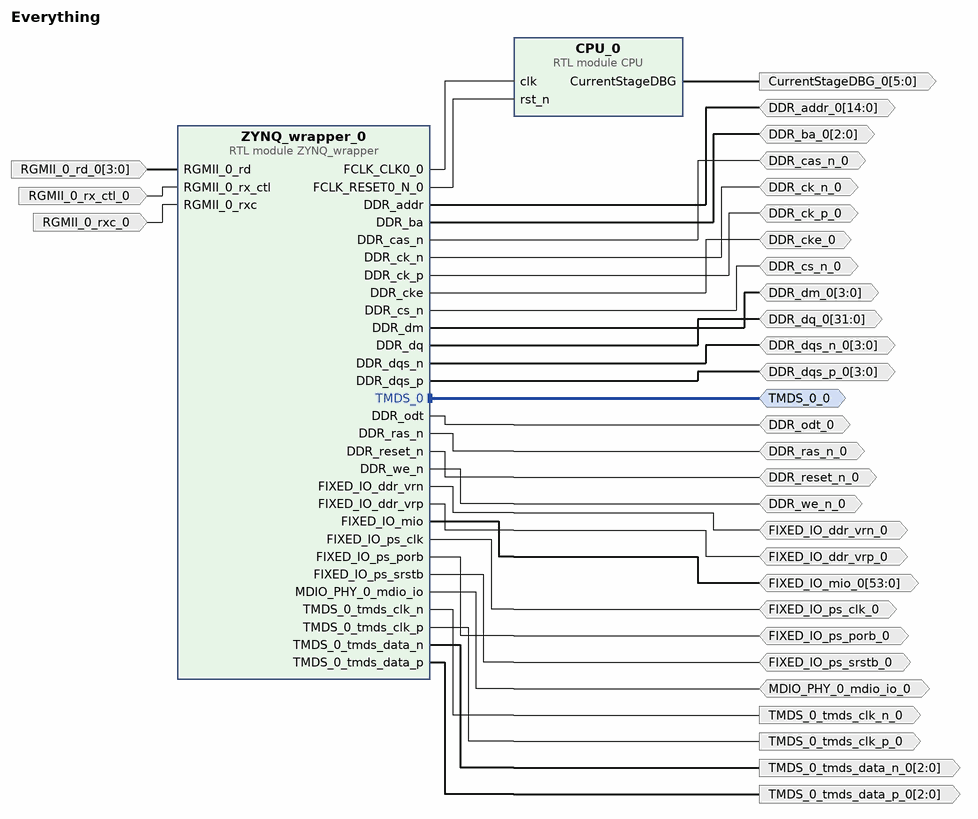
[diagram p0: block diagram of the top level]
# Vivado block design Everything, xc7z020clg484-1, Vivado 2024.1
create_bd_design Everything

create_bd_intf_port -mode Master -vlnv openedv.com:user:TMDS_rtl:1.0 TMDS_0_0
create_bd_port -dir IO -from 14 -to 0 DDR_addr_0
create_bd_port -dir IO -from 2 -to 0 DDR_ba_0
create_bd_port -dir IO DDR_cas_n_0
create_bd_port -dir IO DDR_ck_n_0
create_bd_port -dir IO DDR_ck_p_0
create_bd_port -dir IO DDR_cke_0
create_bd_port -dir IO DDR_cs_n_0
create_bd_port -dir IO -from 3 -to 0 DDR_dm_0
create_bd_port -dir IO -from 31 -to 0 DDR_dq_0
create_bd_port -dir IO -from 3 -to 0 DDR_dqs_n_0
create_bd_port -dir IO -from 3 -to 0 DDR_dqs_p_0
create_bd_port -dir IO DDR_odt_0
create_bd_port -dir IO DDR_ras_n_0
create_bd_port -dir IO DDR_reset_n_0
create_bd_port -dir IO DDR_we_n_0
create_bd_port -dir IO FIXED_IO_ddr_vrn_0
create_bd_port -dir IO FIXED_IO_ddr_vrp_0
create_bd_port -dir IO -from 53 -to 0 FIXED_IO_mio_0
create_bd_port -dir IO -type clk FIXED_IO_ps_clk_0
create_bd_port -dir IO FIXED_IO_ps_porb_0
create_bd_port -dir IO FIXED_IO_ps_srstb_0
create_bd_port -dir I -from 3 -to 0 RGMII_0_rd_0
create_bd_port -dir I RGMII_0_rx_ctl_0
create_bd_port -dir I RGMII_0_rxc_0
create_bd_port -dir IO MDIO_PHY_0_mdio_io_0
create_bd_port -dir O -from 2 -to 0 TMDS_0_tmds_data_n_0
create_bd_port -dir O -from 2 -to 0 TMDS_0_tmds_data_p_0
create_bd_port -dir O -type clk TMDS_0_tmds_clk_p_0
create_bd_port -dir O -type clk TMDS_0_tmds_clk_n_0
create_bd_port -dir O -from 5 -to 0 CurrentStageDBG_0

create_bd_cell -type module -reference CPU CPU_0
create_bd_cell -type module -reference ZYNQ_wrapper ZYNQ_wrapper_0

# ---- connections ----

connect_bd_intf_net [get_bd_intf_ports TMDS_0_0] [get_bd_intf_pins ZYNQ_wrapper_0/TMDS_0]
connect_bd_net [get_bd_pins CPU_0/CurrentStageDBG] [get_bd_ports CurrentStageDBG_0]
connect_bd_net [get_bd_ports DDR_addr_0] [get_bd_pins ZYNQ_wrapper_0/DDR_addr]
connect_bd_net [get_bd_ports DDR_ba_0] [get_bd_pins ZYNQ_wrapper_0/DDR_ba]
connect_bd_net [get_bd_ports DDR_cas_n_0] [get_bd_pins ZYNQ_wrapper_0/DDR_cas_n]
connect_bd_net [get_bd_ports DDR_ck_n_0] [get_bd_pins ZYNQ_wrapper_0/DDR_ck_n]
connect_bd_net [get_bd_ports DDR_ck_p_0] [get_bd_pins ZYNQ_wrapper_0/DDR_ck_p]
connect_bd_net [get_bd_ports DDR_cke_0] [get_bd_pins ZYNQ_wrapper_0/DDR_cke]
connect_bd_net [get_bd_ports DDR_cs_n_0] [get_bd_pins ZYNQ_wrapper_0/DDR_cs_n]
connect_bd_net [get_bd_ports DDR_dm_0] [get_bd_pins ZYNQ_wrapper_0/DDR_dm]
connect_bd_net [get_bd_ports DDR_dq_0] [get_bd_pins ZYNQ_wrapper_0/DDR_dq]
connect_bd_net [get_bd_ports DDR_dqs_n_0] [get_bd_pins ZYNQ_wrapper_0/DDR_dqs_n]
connect_bd_net [get_bd_ports DDR_dqs_p_0] [get_bd_pins ZYNQ_wrapper_0/DDR_dqs_p]
connect_bd_net [get_bd_ports DDR_odt_0] [get_bd_pins ZYNQ_wrapper_0/DDR_odt]
connect_bd_net [get_bd_ports DDR_ras_n_0] [get_bd_pins ZYNQ_wrapper_0/DDR_ras_n]
connect_bd_net [get_bd_ports DDR_reset_n_0] [get_bd_pins ZYNQ_wrapper_0/DDR_reset_n]
connect_bd_net [get_bd_ports DDR_we_n_0] [get_bd_pins ZYNQ_wrapper_0/DDR_we_n]
connect_bd_net [get_bd_ports FIXED_IO_ddr_vrn_0] [get_bd_pins ZYNQ_wrapper_0/FIXED_IO_ddr_vrn]
connect_bd_net [get_bd_ports FIXED_IO_ddr_vrp_0] [get_bd_pins ZYNQ_wrapper_0/FIXED_IO_ddr_vrp]
connect_bd_net [get_bd_ports FIXED_IO_mio_0] [get_bd_pins ZYNQ_wrapper_0/FIXED_IO_mio]
connect_bd_net [get_bd_ports FIXED_IO_ps_clk_0] [get_bd_pins ZYNQ_wrapper_0/FIXED_IO_ps_clk]
connect_bd_net [get_bd_ports FIXED_IO_ps_porb_0] [get_bd_pins ZYNQ_wrapper_0/FIXED_IO_ps_porb]
connect_bd_net [get_bd_ports FIXED_IO_ps_srstb_0] [get_bd_pins ZYNQ_wrapper_0/FIXED_IO_ps_srstb]
connect_bd_net [get_bd_ports MDIO_PHY_0_mdio_io_0] [get_bd_pins ZYNQ_wrapper_0/MDIO_PHY_0_mdio_io]
connect_bd_net -net RGMII_0_rd_0_1 [get_bd_ports RGMII_0_rd_0] [get_bd_pins ZYNQ_wrapper_0/RGMII_0_rd]
connect_bd_net -net RGMII_0_rx_ctl_0_1 [get_bd_ports RGMII_0_rx_ctl_0] [get_bd_pins ZYNQ_wrapper_0/RGMII_0_rx_ctl]
connect_bd_net -net RGMII_0_rxc_0_1 [get_bd_ports RGMII_0_rxc_0] [get_bd_pins ZYNQ_wrapper_0/RGMII_0_rxc]
connect_bd_net [get_bd_pins ZYNQ_wrapper_0/FCLK_CLK0_0] [get_bd_pins CPU_0/clk]
connect_bd_net [get_bd_pins ZYNQ_wrapper_0/FCLK_RESET0_N_0] [get_bd_pins CPU_0/rst_n]
connect_bd_net [get_bd_pins ZYNQ_wrapper_0/TMDS_0_tmds_clk_n] [get_bd_ports TMDS_0_tmds_clk_n_0]
connect_bd_net [get_bd_pins ZYNQ_wrapper_0/TMDS_0_tmds_clk_p] [get_bd_ports TMDS_0_tmds_clk_p_0]
connect_bd_net [get_bd_pins ZYNQ_wrapper_0/TMDS_0_tmds_data_n] [get_bd_ports TMDS_0_tmds_data_n_0]
connect_bd_net [get_bd_pins ZYNQ_wrapper_0/TMDS_0_tmds_data_p] [get_bd_ports TMDS_0_tmds_data_p_0]

validate_bd_design
save_bd_design
